# Altium schematic sheet Regulator_5V0_to_3V3.SchDoc: Linear Voltage Regulator_5V0_to_3V3
size A4; Date: 03/08/2025; DocumentNumber: 2; Revision: 0; SheetNumber: 2; SheetTotal: 3
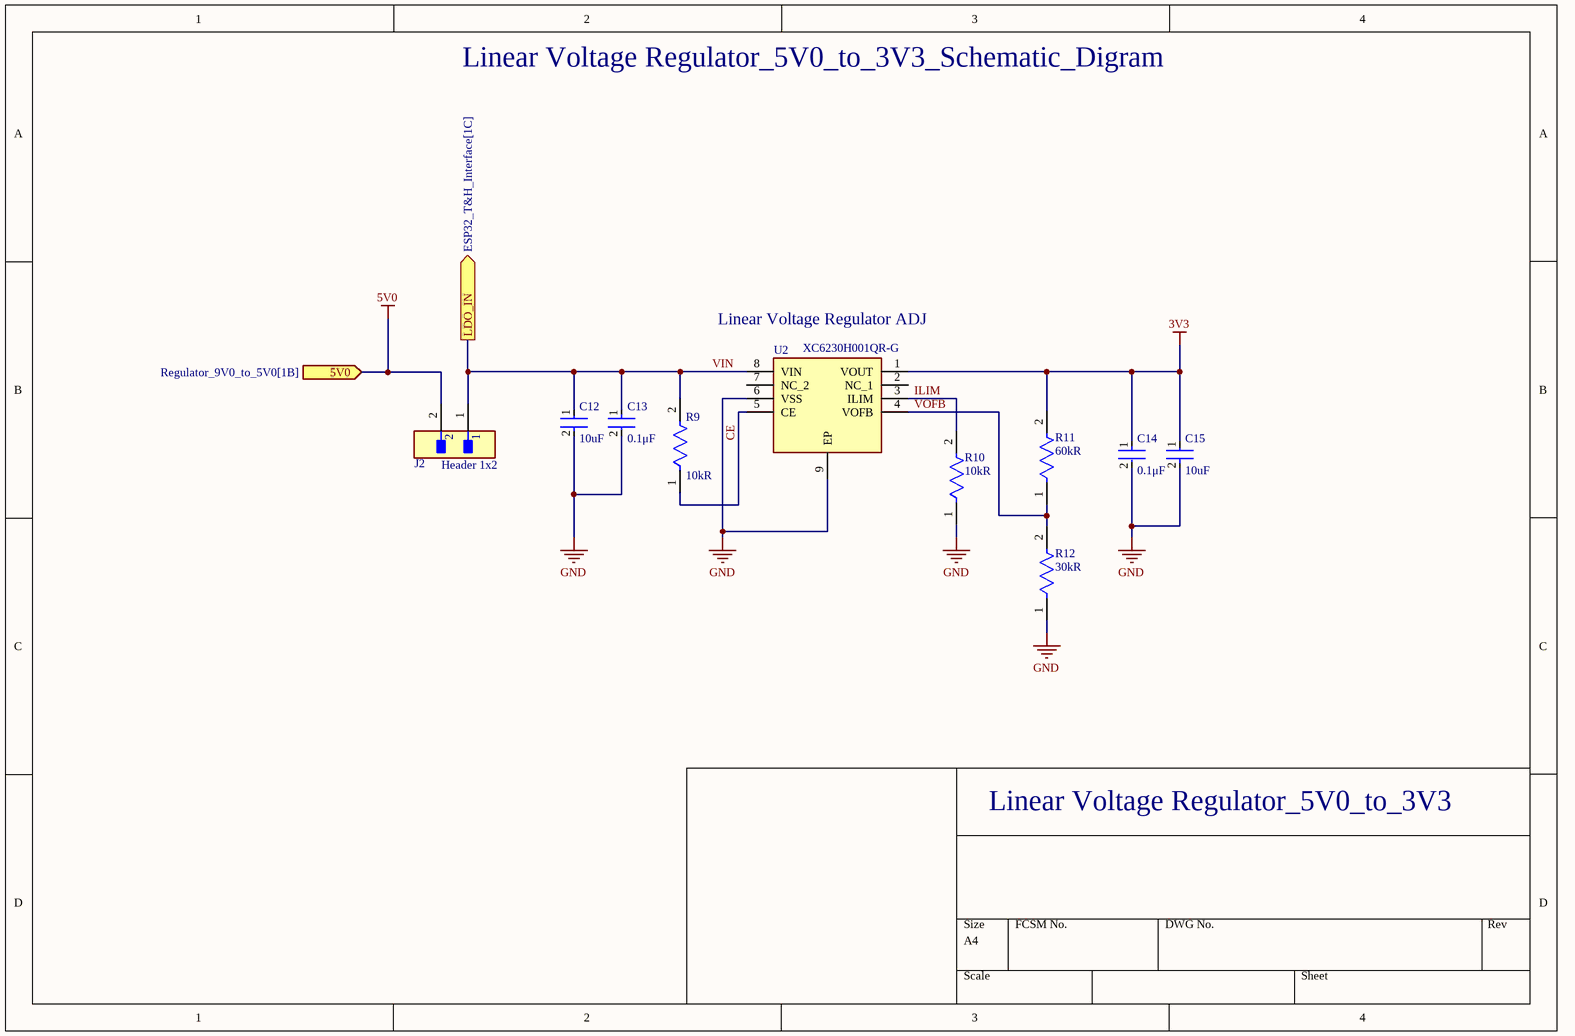
[diagram p0: Regulator_5V0_to_3V3.SchDoc]

## Parts
C12  Capacitance: 10uF  [FP-C1608-080-0_1-IPC_A]  (hidden comment: C1608X5R1A106M080AC)
C13  Capacitance: 0.1μF  [FP-C0603C-CF-MFG]  (hidden comment: C0603C104K8RACTU)
C14  Capacitance: 0.1μF  [FP-C0603C-CF-MFG]  (hidden comment: C0603C104K8RACTU)
C15  Capacitance: 10uF  [FP-C1608-080-0_1-IPC_A]  (hidden comment: C1608X5R1A106M080AC)
J2  Header 1x2  [FP-M20-9990245-MFG]
R9  Resistance: 10kR  [FP-AC0402-MFG]  (hidden comment: AC0402FR-0710KL)
R10  Resistance: 10kR  [FP-AC0402-MFG]  (hidden comment: AC0402FR-0710KL)
R11  Resistance: 60kR  [FP-MCR01-IPC_A]  (hidden comment: MCR01MRTF3002)
R12  Resistance: 30kR  [FP-MCR01-IPC_A]  (hidden comment: MCR01MRTF3002)
U2  XC6230H001QR-G  [XC6230H001]

## Ports
5V0 (in, see Regulator_9V0_to_5V0[1B]), LDO_IN (out, see ESP32_T&H_Interface[1C])

## Nets
3V3: C14.1 C15.1 R11.2 U2.1(VOUT)
5V0: J2.2 ; port 5V0
GND: C12.2 C13.2 C14.2 C15.2 R10.1 R12.1 U2.6(VSS) U2.9(EP)
CE: R9.1 U2.5(CE)
ILIM: R10.2 U2.3(ILIM)
VIN: C12.1 C13.1 J2.1 R9.2 U2.8(VIN) ; port LDO_IN
VOFB: R11.1 R12.2 U2.4(VOFB)

Not connected (* = marked no-connect by the designer): U2 2(NC_1) 7(NC_2)

## Notes on the sheet
- Linear Voltage Regulator_5V0_to_3V3_Schematic_Digram
- (near U2) Linear Voltage Regulator ADJ
- Linear Voltage Regulator_5V0_to_3V3

## Library data of the parts
C12 C15 = CMP-2000-04980-2: Multilayer Ceramic Capacitors 10μF ±20% 10V X5R SMD 0603; Min Operating Temperature: -55°C; RoHS Compliant: Yes; Package Quantity: 1; Max Operating Temperature: 85°C; Radiation Hardening: No; Packaging: Tape and Reel; REACH SVHC: No SVHC; Length: 1.6mm; Case/Package: 0603; Series: C; Voltage Rating: 10V; Thickness: 0.035inch; Weight: 7.1E-05oz; Dielectric: X5R; Termination: SMD/SMT; Dielectric Material: Ceramic; Mount: Surface Mount; Construction: Flat; Resistor Type: Ceramic; Tolerance: 20%; Case Code (Metric): 1608; Number of Pins: 2; Case Code (Imperial): 0603; Depth: 0.8mm; Lead Free: Lead Free; Width: 0.031inch; Height: 0.8mm; Voltage Rating (DC): 10V
C13 C14 = CMP-1035-02580-3: CAP CER 0.1UF 10V X7R 0603; Manufacturer: KEMET; Tolerance: 0.1; Material: Ceramic; Value: 0.10 μF; Temperature Coefficient: 30ppm/°C; Automotive Grade: Grade 1; Digikey Description: CAP CER 0.1UF 10V X7R 0603; Temperature Range High: +125°C; RoHS: TRUE; ComponentLink2URL: https://api.kemet.com/component-edge/download/datasheet/C0603C100J5GACAUTO.pdf; Lead Free: Yes; Device Class L2: Capacitors; Mouser Description: Multilayer Ceramic Capacitors MLCC - SMD/SMT 10volts 0.1uF X7R 10%; Temperature: -55°C to +125°C; Category: Cap; Height: 0.87mm; Voltage Rating: 10 V; Device Class L3: Ceramic Capacitors; ComponentLink2Description: Datasheet; Automotive: Yes; Manufacturer Part Number: C0603C104K8RACTU; Octopart: https://octopart.com/c0603c104k8ractu-kemet-145075; Temperature Characteristic: X7R; Device Class L1: Passive Components; Temperature Range Low: -55°C; Package: C0603C-CF
J2 = CMP-15831-000105-1: CONN HEADER VERT 2POS 2.54MM; Working Voltage: 750V; Gender: Male; Number of Poles: 2; Current Rating: 3A; Mated Stacking Heights: 16.54mm; Contact Resistance: 25mR; Connector Type: Male Pin; Insulation Resistance: 10GR; Mating Cycles: 300; Voltage: 50V; Flammability Rating: UL94 V-0; Pitch: 2.54mm; Series: M20; Number of Contacts: 2; Height: 0.12inch; Min Operating Temperature: -40°C; Contact Finish - Mating: GOLD; Number of Positions: 2; Number of Rows: 1; Packaging: Bulk; Package Quantity: 1000; Voltage Rating (AC): 750V; Current: 3A; Mount: Through Hole; Case/Package: SIL; Orientation: Straight; Contact Shape: Square; Weight: 0.25lb; Radiation Hardening: No; Fastening Type: Pull; Length: 5.08mm; Depth: 2.54mm; Contact Mating Length: 0.24inch; Housing Material: Nylon; Reach SVHC Compliant: Yes; Insulation Material: Nylon; Color: Black; Width: 0.25inch; Insulation Color: Black; Contact Material: Brass; Contact Type: Male Pin; Termination: Solder; Max Operating Temperature: 105°C; Contact Plating: Gold; Housing Color: Black; Max Current Rating: 3A; Lead Pitch: 2.54mm
R9 R10 = CMP-2002-01790-3: RES 10kΩ ±1% 0.063W 0402; Power Rating: 62.5mW; Voltage Rating: 50V; Temperature Coefficient: 100ppm/°C; Max Power Dissipation: 63mW; Tolerance: 1%; Military Standard: Not; Construction: Rectangular; Termination: SMD/SMT; Max Operating Temperature: 155°C; Min Operating Temperature: -55°C; Height: 0.015inch; Lead Free: Lead Free; Width: 0.02inch; Case/Package: 0402; Resistor Type: Thick Film; Series: AC; Features: Moisture Resistant; RoHS Compliant: Yes; Number of Terminations: 2; Case Code (Metric): 1005; Length: 0.039inch; Depth: 0.5mm; Size Code: 0402; Packaging: Tape and Reel; Case Code (Imperial): 0402
R11 = CMP-08839-016222-1: Thick Film Chip Resistor, 0402, 60kΩ, 1%, 100ppm/°C, 0.063W, 50V; Max Power Dissipation: 63mW; Voltage Rating (DC): 50V; Min Operating Temperature: -55°C; Case Code (Metric): 1005; RoHS Compliant: Yes; Case/Package: 0402; Number of Terminations: 2; Case Code (Imperial): 0402; Height: 0.016inch; Tolerance: 1%; Resistor Type: Thick Film; Length: 0.039inch; Max Operating Temperature: 155°C; Temperature Coefficient: 100ppm/°C; Package Quantity: 10000; Packaging: Tape and Reel; Width: 0.02inch
R12 = CMP-08839-016222-1: Thick Film Chip Resistor, 0402, 30kΩ, 1%, 100ppm/°C, 0.063W, 50V; Max Power Dissipation: 63mW; Voltage Rating (DC): 50V; Min Operating Temperature: -55°C; Case Code (Metric): 1005; RoHS Compliant: Yes; Case/Package: 0402; Number of Terminations: 2; Case Code (Imperial): 0402; Height: 0.016inch; Tolerance: 1%; Resistor Type: Thick Film; Length: 0.039inch; Max Operating Temperature: 155°C; Temperature Coefficient: 100ppm/°C; Package Quantity: 10000; Packaging: Tape and Reel; Width: 0.02inch
U2 = XC6230H001QR-G: Integrated Circuit; Manufacturer_Name: Torex; Datasheet Link: https://torex.componentsearchengine.com/Datasheets/2/XC6230H001QR-G.pdf; Height: 1.75mm; Manufacturer_Part_Number: XC6230H001QR-G; Mouser Part Number: 865-XC6230H001QR-G; Mouser Price/Stock: https://www.mouser.co.uk/ProductDetail/Torex-Semiconductor/XC6230H001QR-G?qs=T3oQrply3y%252BzJb5jKbBeQw%3D%3D